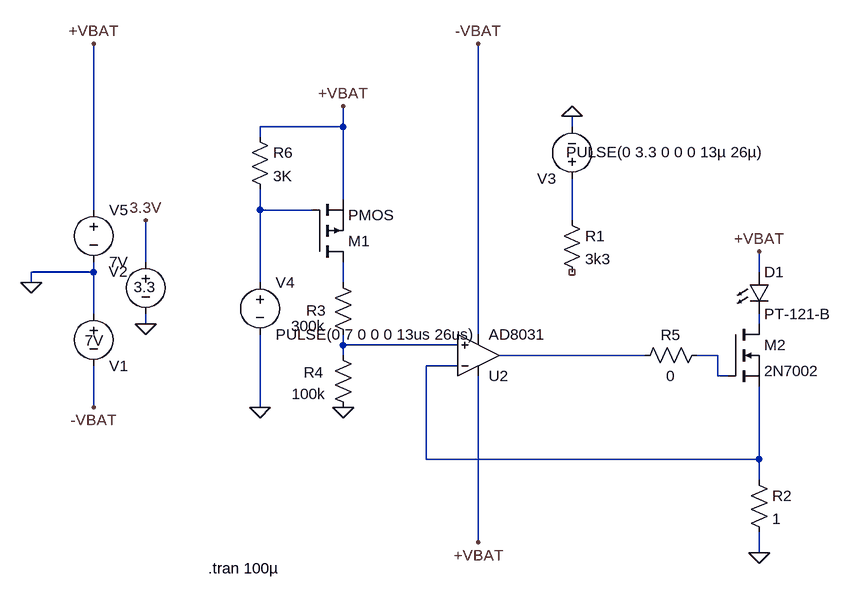
[diagram p0: schematic IR-Led-Constant_Current.asc]
IR-Led-Constant_Current.asc, the LTspice schematic file:
Version 4
SHEET 1 880 680
WIRE -48 -240 -48 -272
WIRE -48 -240 -176 -240
WIRE 304 -240 304 -256
WIRE -176 -224 -176 -240
WIRE -48 -128 -48 -240
WIRE -432 -112 -432 -368
WIRE -176 -112 -176 -144
WIRE -96 -112 -176 -112
WIRE 304 -96 304 -160
WIRE -352 -32 -352 -96
WIRE -432 -16 -432 -32
WIRE -432 -16 -528 -16
WIRE 592 -16 592 -48
WIRE -528 0 -528 -16
WIRE -176 0 -176 -112
WIRE -48 0 -48 -32
WIRE -432 48 -432 -16
WIRE -352 64 -352 48
WIRE 592 64 592 48
WIRE 160 80 160 -368
WIRE -48 96 -48 80
WIRE 128 96 -48 96
WIRE -48 112 -48 96
WIRE 416 112 192 112
WIRE 528 112 496 112
WIRE 128 128 80 128
WIRE 528 144 528 112
WIRE 544 144 528 144
WIRE -432 192 -432 128
WIRE -176 192 -176 80
WIRE 80 272 80 128
WIRE 592 272 592 160
WIRE 592 272 80 272
WIRE 592 304 592 272
WIRE 160 400 160 144
WIRE 592 416 592 384
FLAG -352 64 0
FLAG 304 -256 0
FLAG 592 416 0
FLAG -48 192 0
FLAG -48 -272 +VBAT
FLAG -352 -96 3.3V
FLAG -176 192 0
FLAG -528 0 0
FLAG -432 -368 +VBAT
FLAG -432 192 -VBAT
FLAG 160 -368 -VBAT
FLAG 160 400 +VBAT
FLAG 592 -48 +VBAT
SYMBOL voltage -352 -48 R0
WINDOW 0 -57 31 Left 2
WINDOW 3 -18 55 Left 2
WINDOW 123 0 0 Left 0
WINDOW 39 0 0 Left 0
SYMATTR InstName V2
SYMATTR Value 3.3
SYMBOL voltage -432 32 R0
WINDOW 0 24 96 Left 2
WINDOW 3 1 57 Center 2
WINDOW 123 0 0 Left 0
WINDOW 39 0 0 Left 0
SYMATTR InstName V1
SYMATTR Value 7V
SYMBOL res 576 288 R0
SYMATTR InstName R2
SYMATTR Value 1
SYMATTR SpiceLine pwr=1
SYMBOL LED 576 -16 R0
SYMATTR InstName D1
SYMATTR Value PT-121-B
SYMBOL res -64 -16 R0
WINDOW 0 -41 59 Left 2
WINDOW 3 -64 83 Left 2
SYMATTR InstName R3
SYMATTR Value 300k
SYMBOL res -64 96 R0
WINDOW 0 -45 42 Left 2
WINDOW 3 -63 75 Left 2
SYMATTR InstName R4
SYMATTR Value 100k
SYMBOL voltage 304 -144 R180
WINDOW 123 0 0 Left 0
WINDOW 39 0 0 Left 0
WINDOW 3 -295 57 Left 2
SYMATTR Value PULSE(0 3.3 0 0 0 13µ 26µ)
SYMATTR InstName V3
SYMBOL res 288 -112 R0
SYMATTR InstName R1
SYMATTR Value 3k3
SYMBOL res 512 96 R90
WINDOW 0 0 56 VBottom 2
WINDOW 3 32 56 VTop 2
SYMATTR InstName R5
SYMATTR Value 0
SYMBOL OpAmps\\AD8031 160 176 M180
SYMATTR InstName U2
SYMBOL res -192 -240 R0
SYMATTR InstName R6
SYMATTR Value 3K
SYMBOL voltage -176 -16 R0
WINDOW 123 0 0 Left 0
WINDOW 39 0 0 Left 0
SYMATTR InstName V4
SYMATTR Value PULSE(0 7 0 0 0 13us 26us)
SYMBOL nmos 544 64 R0
SYMATTR InstName M2
SYMATTR Value 2N7002
SYMBOL voltage -432 -128 R0
WINDOW 123 0 0 Left 0
WINDOW 39 0 0 Left 0
SYMATTR InstName V5
SYMATTR Value 7V
SYMBOL pmos -96 -32 M180
SYMATTR InstName M1
TEXT -256 440 Left 2 !.tran 100µ

The netlist it stands for:
* IR-Led-Constant_Current.asc
V2 3.3V 0 3.3
V1 0 -VBAT 7V
R2 N008 0 1 pwr=1
D1 +VBAT N004 PT-121-B
R3 N003 N005 300k
R4 N005 0 100k
V3 N002 0 PULSE(0 3.3 0 0 0 13µ 26µ)
R1 N002 NC_01 3k3
R5 N007 N006 0
XU2 N005 N008 +VBAT -VBAT N006 AD8031  ; pins In+ In- V+ V- OUT
R6 +VBAT N001 3K
V4 N001 0 PULSE(0 7 0 0 0 13us 26us)
M2 N004 N007 N008 N008 2N7002
V5 +VBAT 0 7V
M1 N003 N001 +VBAT +VBAT PMOS
.model D D
.lib standard.dio
.model NMOS NMOS
.model PMOS PMOS
.lib standard.mos
.tran 100µ
.backanno
.end